# Altium project stend_update.PrjPcb
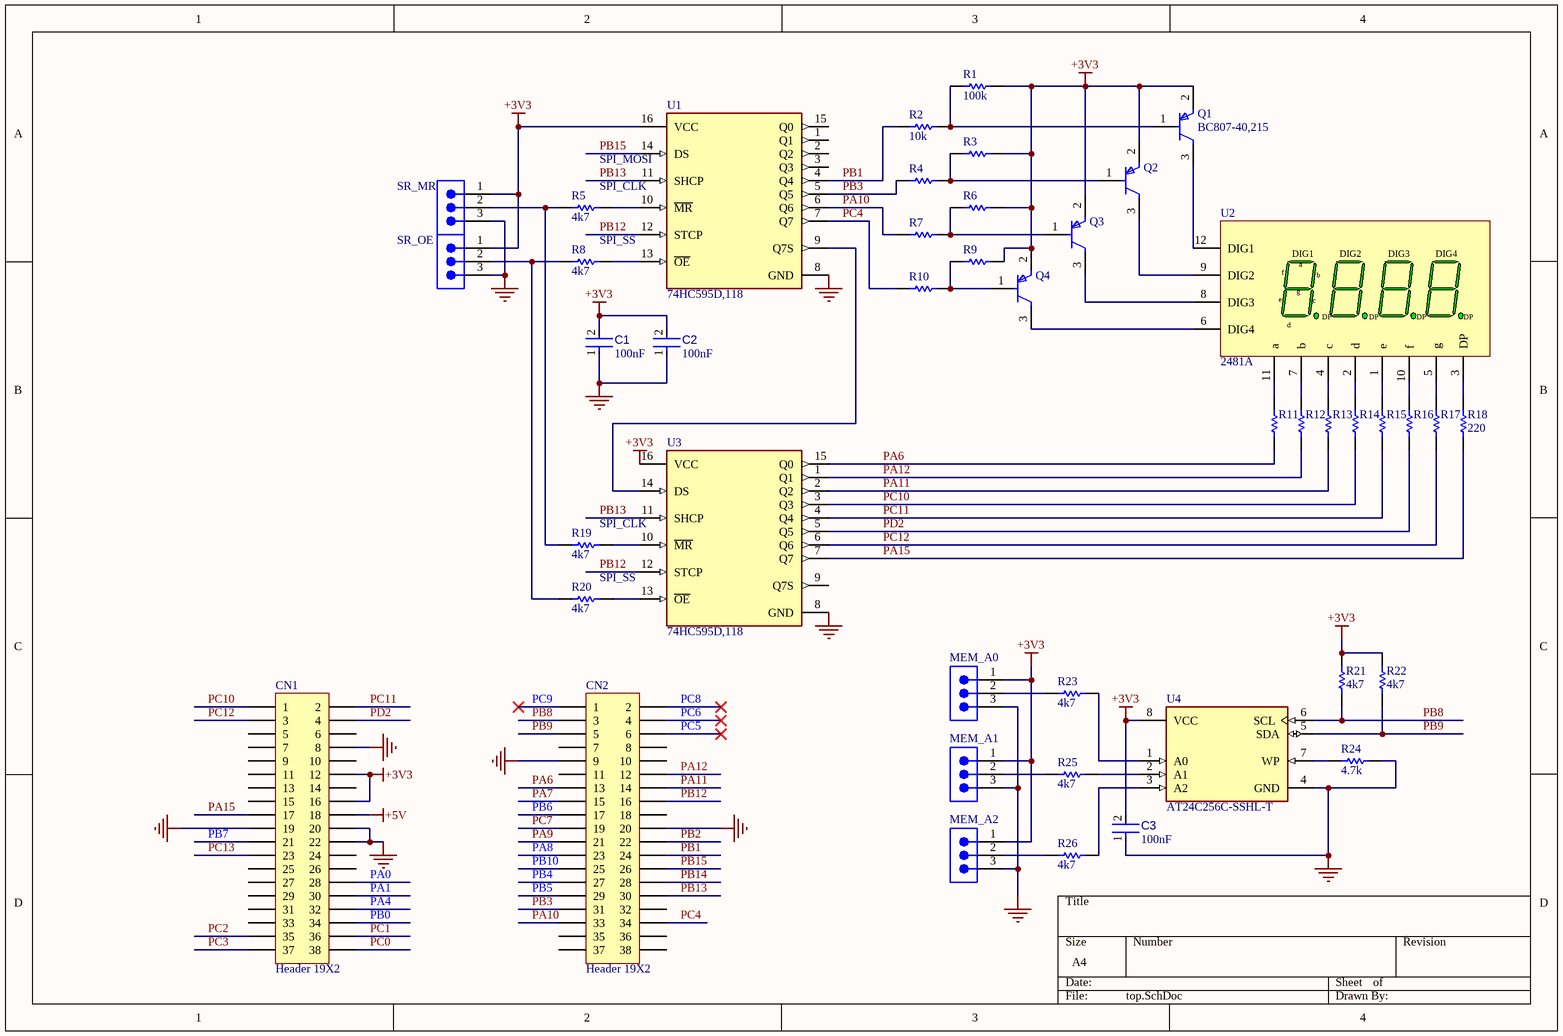
[diagram p0: top.SchDoc]
1 sheet, 44 parts. Net scope: global (net labels, ports and power ports of the same name join across sheets).
Board file: board.PcbDoc

## Sheet top.SchDoc
size A4

### Parts
C1  Capacitance: 100nF  [FP-0603-L_1_6_0_1-W_0_8_0-IPC_A]  (hidden comment: UMK107BJ104KAHT)
C2  Capacitance: 100nF  [FP-0603-L_1_6_0_1-W_0_8_0-IPC_A]  (hidden comment: UMK107BJ104KAHT)
C3  Capacitance: 100nF  [FP-0603-L_1_6_0_1-W_0_8_0-IPC_A]  (hidden comment: UMK107BJ104KAHT)
CN1  Header 19X2  [2*19P]
CN2  Header 19X2  [2*19P]
MEM_A0  TSW-103-07-F-S  [SMTC-TSW-103-07-X-S]  (value not drawn)
MEM_A1  TSW-103-07-F-S  [SMTC-TSW-103-07-X-S]  (value not drawn)
MEM_A2  TSW-103-07-F-S  [SMTC-TSW-103-07-X-S]  (value not drawn)
Q1  BC807-40,215  [FP-SOT23-IPC_A]
Q2  BC807-40,215  [FP-SOT23-IPC_A]  (value not drawn)
Q3  BC807-40,215  [FP-SOT23-IPC_A]  (value not drawn)
Q4  BC807-40,215  [FP-SOT23-IPC_A]  (value not drawn)
R1  value 100k  [RESC1609X55X30ML15T15]  (hidden comment: ERJ3EKF1002V)
R2  value 10k  [RESC1609X55X30ML15T15]  (hidden comment: ERJ3EKF1002V)
R3  ERJ3EKF1002V  [RESC1609X55X30ML15T15]  (value not drawn)
R4  ERJ3EKF1002V  [RESC1609X55X30ML15T15]  (value not drawn)
R5  value 4k7  [RESC1608X55X30ML15T15]  (hidden comment: ERJ-3EKF4701V)
R6  ERJ3EKF1002V  [RESC1609X55X30ML15T15]  (value not drawn)
R7  ERJ3EKF1002V  [RESC1609X55X30ML15T15]  (value not drawn)
R8  value 4k7  [RESC1608X55X30ML15T15]  (hidden comment: ERJ-3EKF4701V)
R9  ERJ3EKF1002V  [RESC1609X55X30ML15T15]  (value not drawn)
R10  ERJ3EKF1002V  [RESC1609X55X30ML15T15]  (value not drawn)
R11  ERJ3EKF1002V  [RESC1609X55X30ML15T15]  (value not drawn)
R12  ERJ3EKF1002V  [RESC1609X55X30ML15T15]  (value not drawn)
R13  ERJ3EKF1002V  [RESC1609X55X30ML15T15]  (value not drawn)
R14  ERJ3EKF1002V  [RESC1609X55X30ML15T15]  (value not drawn)
R15  ERJ3EKF1002V  [RESC1609X55X30ML15T15]  (value not drawn)
R16  ERJ3EKF1002V  [RESC1609X55X30ML15T15]  (value not drawn)
R17  ERJ3EKF1002V  [RESC1609X55X30ML15T15]  (value not drawn)
R18  value 220  [RESC1609X55X30ML15T15]  (hidden comment: ERJ3EKF1002V)
R19  value 4k7  [RESC1608X55X30ML15T15]  (hidden comment: ERJ-3EKF4701V)
R20  value 4k7  [RESC1608X55X30ML15T15]  (hidden comment: ERJ-3EKF4701V)
R21  value 4k7  [RESC1608X55X30ML15T15]  (hidden comment: ERJ-3EKF4701V)
R22  value 4k7  [RESC1608X55X30ML15T15]  (hidden comment: ERJ-3EKF4701V)
R23  value 4k7  [RESC1608X55X30ML15T15]  (hidden comment: ERJ-3EKF4701V)
R24  Resistance: 4.7k  [RESC1608X55X25ML10T15]  (hidden comment: RC0603FR-074K7L)
R25  value 4k7  [RESC1608X55X30ML15T15]  (hidden comment: ERJ-3EKF4701V)
R26  value 4k7  [RESC1608X55X30ML15T15]  (hidden comment: ERJ-3EKF4701V)
SR_MR  TSW-103-07-F-S  [SMTC-TSW-103-07-X-S]  (value not drawn)
SR_OE  TSW-103-07-F-S  [SMTC-TSW-103-07-X-S]  (value not drawn)
U1  74HC595D,118  [FP-SOT109-1-IPC_C]
U2  2481A  [2481A]
U3  74HC595D,118  [FP-SOT109-1-IPC_C]
U4  AT24C256C-SSHL-T  [FP-C04-057-SN-MFG]

### Nets
+3V3: C1.2 C2.2 C3.2 CN1.12 CN1.16 MEM_A0.1 MEM_A1.1 MEM_A2.1 Q1.2(E) Q2.2(E) Q3.2(E) Q4.2(E) R1.2 R3.2 R6.2 R9.2 R21.2 R22.2 SR_MR.1 SR_OE.1 U1.16(VCC) U3.16(VCC) U4.8(VCC)
+5V: CN1.18
GND: C1.1 C2.1 C3.1 CN1.8 CN1.19 CN1.20 CN1.22 CN2.9 CN2.20 MEM_A0.3 MEM_A1.3 MEM_A2.3 R24.2 SR_MR.3 SR_OE.3 U1.8(GND) U3.8(GND) U4.4(GND)
PA0: CN1.28
PA1: CN1.30
PA4: CN1.32
PA6: CN2.13 R11.1 U3.15(Q0)
PA7: CN2.15
PA8: CN2.23
PA9: CN2.21
PA10: CN2.33 R7.1 U1.6(Q6)
PA11: CN2.14 R13.1 U3.2(Q2)
PA12: CN2.12 R12.1 U3.1(Q1)
PA15: CN1.17 R18.1 U3.7(Q7)
PB0: CN1.34
PB1: CN2.24 R2.1 U1.4(Q4)
PB2: CN2.22
PB3: CN2.31 R4.1 U1.5(Q5)
PB4: CN2.27
PB5: CN2.29
PB6: CN2.17
PB7: CN1.21
PB8: CN2.3 R21.1 U4.6(SCL)
PB9: CN2.5 R22.1 U4.5(SDA)
PB10: CN2.25
PB12: CN2.16 U1.12(STCP) U3.12(STCP)
PB13: CN2.30 U1.11(SHCP) U3.11(SHCP)
PB14: CN2.28
PB15: CN2.26 U1.14(DS)
PC0: CN1.38
PC1: CN1.36
PC2: CN1.35
PC3: CN1.37
PC4: CN2.34 R10.1 U1.7(Q7)
PC5: CN2.6
PC6: CN2.4
PC7: CN2.19
PC8: CN2.2
PC9: CN2.1
PC10: CN1.1 R14.1 U3.3(Q3)
PC11: CN1.2 R15.1 U3.4(Q4)
PC12: CN1.3 R17.1 U3.6(Q6)
PC13: CN1.23
PD2: CN1.4 R16.1 U3.5(Q5)
NetMEM_A0_2: MEM_A0.2 R23.2
NetMEM_A1_2: MEM_A1.2 R25.2
NetMEM_A2_2: MEM_A2.2 R26.2
NetQ1_1: Q1.1(B) R1.1 R2.2
NetQ1_3: Q1.3(C) U2.12(DIG1)
NetQ2_1: Q2.1(B) R3.1 R4.2
NetQ2_3: Q2.3(C) U2.9(DIG2)
NetQ3_1: Q3.1(B) R6.1 R7.2
NetQ3_3: Q3.3(C) U2.8(DIG3)
NetQ4_1: Q4.1(B) R9.1 R10.2
NetQ4_3: Q4.3(C) U2.6(DIG4)
NetR5_1: R5.1 U1.10(~{MR})
NetR5_2: R5.2 R19.2 SR_MR.2
NetR8_1: R8.1 U1.13(~{OE})
NetR8_2: R8.2 R20.2 SR_OE.2
NetR11_2: R11.2 U2.11(a)
NetR12_2: R12.2 U2.7(b)
NetR13_2: R13.2 U2.4(c)
NetR14_2: R14.2 U2.2(d)
NetR15_2: R15.2 U2.1(e)
NetR16_2: R16.2 U2.10(f)
NetR17_2: R17.2 U2.5(g)
NetR18_2: R18.2 U2.3(DP)
NetR19_1: R19.1 U3.10(~{MR})
NetR20_1: R20.1 U3.13(~{OE})
NetR23_1: R23.1 U4.1(A0)
NetR24_1: R24.1 U4.7(WP)
NetR25_1: R25.1 U4.2(A1)
NetR26_1: R26.1 U4.3(A2)
NetU1_9: U1.9(Q7S) U3.14(DS)

Not connected (* = marked no-connect by the designer): CN1 5 6 7 9 10 11 13 14 15 24 25 26 27 29 31 33; CN2 7 8 10 11 18 32 35 36 37 38; U1 1(Q1) 2(Q2) 3(Q3) 15(Q0); U3 9(Q7S)

### Notes on the sheet
- (near U1) SPI_MOSI
- (near R8) SPI_SS
- (near R5) SPI_CLK
- (near R20) SPI_SS
- (near R19) SPI_CLK

### Library data of the parts
C1-C3 = CMP-14477-000532-1: Ceramic Capacitor Automotive 0.1uF ±10% 50V X5R 0603; Packaging: Tape and Reel; RoHS Compliant: Yes; Length: 0.063inch; Tolerance: 10%; Voltage Rating: 50V; Min Operating Temperature: -55°C; Ratings: AEC-Q200; Width: 0.031inch; Thickness: 0.035inch; Mount: Surface Mount; Height: 0.8mm; Termination: SMD/SMT; Dielectric: X5R; Package Quantity: 4000; Voltage Rating (DC): 50V; Case Code (Metric): 1608; Lead Free: Lead Free; Halogen Free: Halogen Free; Case/Package: 0603; Case Code (Imperial): 0603; Max Operating Temperature: 85°C
CN1 CN2 = Header 19X2: Header, 19-Pin, Dual row; Revision: 17-Jul-2002: Re-released for DXP Platform.; Publisher: Altium Limited
MEM_A0-MEM_A2 SR_MR SR_OE = CMP-1024-00331-1: 0.025" SQ Post Header, Through-hole, Vertical, -55 to 125 degC, 2.54 mm Pitch, 3-Pin, Male, RoHS; Manufacturer: Samtec; Pitch: 2.54 mm; DatasheetVersion: F-214; ComponentLink1Description: Manufacturer URL; ComponentLink3URL: http://www.samtec.com/documents/webfiles/cpdf/TSW-XXX-XX-XXX-X-XX-XXX-MKT.pdf; Mounting Technology: Through-hole; PackageDescription: .025[0.64] SQ. Post Terminal Strip Assembly; Temperature Range: -55 to 125 degC; ComponentLink3Description: Package Specification; Orientation: Vertical; PartNumber: TSW-103-07-F-S; RoHS: True; PackageVersion: DM, 8/1988; ComponentLink2Description: Datasheet; ComponentLink1URL: http://www.samtec.com; ComponentLink2URL: http://www.samtec.com/documents/webfiles/pdf/TSW_TH.PDF; PackageReference: TSW-103-07-X-S
Q1-Q4 = CMP-14406-000042-1: TRANS PNP 45V 500MA TO236AB; RoHS Compliant: Yes
R1 R2 R18 = CMP-1012-00623-3: Chip Resistor, 10 KOhm, +/- 1%, 0.1 W, -55 to 155 degC, 0603 (1608 Metric), RoHS, Tape and Reel; Manufacturer: Panasonic; Voltage Rating: 75V; Case\/Package: 0603; Power Rating: 100mW; Resistance: 10KOhm; Temperature Coefficient: 100ppm\/degreesC; Number of Pins: 2; Package Reference: 603; Depth: 0.8mm; Mount: SurfaceMount; Package Description: 2-Pin Surface Mount Device, Body 1.6 x 0.85 mm; Datasheet Version: 02/2017; Length: 1.6mm; Lead Free: LeadFree; Height: 0.45mm; Number of Terminations: 2; Max Power Dissipation: 100mW; Min Operating Temperature: -55degC; Datasheet URL: https://industrial.panasonic.com/cdbs/www-data/pdf/RDA0000/AOA0000C304.pdf; Termination: SMD/SMT; Case Code (Metric): 1608; Case Code (Imperial): 0603; Tolerance: 1%; Max Operating Temperature: 155degC; RoHSCompliant: true; Voltage Rating (DC): 75V; Radiation Hardening: No; Packaging: TapeandReel; Composition: ThickFilm; Mounting Technology: SurfaceMount; Manufacturer URL: http://www.panasonic.com/; Width: 0.031inch; REACH SVHC: NoSVHC; Contact Plating: Tin; Military Standard: Not; Package Quantity: 1
R3 R6 R9 = CMP-1012-00623-3: Chip Resistor, 10 KOhm, +/- 1%, 0.1 W, -55 to 155 degC, 0603 (1608 Metric), RoHS, Tape and Reel; Manufacturer: Panasonic; Voltage Rating: 75V; Case\/Package: 0603; Power Rating: 100mW; Resistance: 10KOhm; Temperature Coefficient: 100ppm\/degreesC; Value: 100k; Number of Pins: 2; Package Reference: 603; Depth: 0.8mm; Mount: SurfaceMount; Package Description: 2-Pin Surface Mount Device, Body 1.6 x 0.85 mm; Datasheet Version: 02/2017; Length: 1.6mm; Lead Free: LeadFree; Height: 0.45mm; Number of Terminations: 2; Max Power Dissipation: 100mW; Min Operating Temperature: -55degC; Datasheet URL: https://industrial.panasonic.com/cdbs/www-data/pdf/RDA0000/AOA0000C304.pdf; Termination: SMD/SMT; Case Code (Metric): 1608; Case Code (Imperial): 0603; Tolerance: 1%; Max Operating Temperature: 155degC; RoHSCompliant: true; Voltage Rating (DC): 75V; Radiation Hardening: No; Packaging: TapeandReel; Composition: ThickFilm; Mounting Technology: SurfaceMount; Manufacturer URL: http://www.panasonic.com/; Width: 0.031inch; REACH SVHC: NoSVHC; Contact Plating: Tin; Military Standard: Not; Package Quantity: 1
R4 R7 R10 = CMP-1012-00623-3: Chip Resistor, 10 KOhm, +/- 1%, 0.1 W, -55 to 155 degC, 0603 (1608 Metric), RoHS, Tape and Reel; Manufacturer: Panasonic; Voltage Rating: 75V; Case\/Package: 0603; Power Rating: 100mW; Resistance: 10KOhm; Temperature Coefficient: 100ppm\/degreesC; Value: 10k; Number of Pins: 2; Package Reference: 603; Depth: 0.8mm; Mount: SurfaceMount; Package Description: 2-Pin Surface Mount Device, Body 1.6 x 0.85 mm; Datasheet Version: 02/2017; Length: 1.6mm; Lead Free: LeadFree; Height: 0.45mm; Number of Terminations: 2; Max Power Dissipation: 100mW; Min Operating Temperature: -55degC; Datasheet URL: https://industrial.panasonic.com/cdbs/www-data/pdf/RDA0000/AOA0000C304.pdf; Termination: SMD/SMT; Case Code (Metric): 1608; Case Code (Imperial): 0603; Tolerance: 1%; Max Operating Temperature: 155degC; RoHSCompliant: true; Voltage Rating (DC): 75V; Radiation Hardening: No; Packaging: TapeandReel; Composition: ThickFilm; Mounting Technology: SurfaceMount; Manufacturer URL: http://www.panasonic.com/; Width: 0.031inch; REACH SVHC: NoSVHC; Contact Plating: Tin; Military Standard: Not; Package Quantity: 1
R5 R8 R19-R23 R25 R26 = CMP-1012-00586-3: Precision Thick Film Chip Resistor, 4.7 KOhm, +/- 1%, -55 to 155 degC, 0603 (1608 Metric), RoHS, Tape and Reel; Resistance: 220 Ohm; Voltage Rating: 50 V; Elements: 4; Case\Package: 1205; Tolerance: 5%; Power Rating: 250 mW; PackageReference: 0603; Max Operating Temperature: 125 degC; REACH SVHC: No SVHC; Width: 0.063 inch; Length: 0.126 inch; Height: 0.024 inch; Mount: Surface Mount; Package Quantity: 1; DatasheetVersion: Apr-15; ComponentLink1Description: Manufacturer URL; Min Operating Temperature: -55 degC; Packaging: Tape and Reel; Radiation Hardening: No; ComponentLink2URL: http://industrial.panasonic.com/cdbs/www-data/pdf/RDA0000/AOA0000C86.pdf; Case Code (Metric): 3216; Pins: 8; Case Code (Imperial): 1206; Type (Resistor): Thick Film; RoHSCompliant: true; ComponentLink2Description: Datasheet; PackageDescription: 2-Pin Surface Mount Device, Body 1.6 x 0.85 mm; ComponentLink1URL: http://www.panasonic.com/
R11-R17 = CMP-1012-00623-3: Chip Resistor, 10 KOhm, +/- 1%, 0.1 W, -55 to 155 degC, 0603 (1608 Metric), RoHS, Tape and Reel; Manufacturer: Panasonic; Voltage Rating: 75V; Case\/Package: 0603; Power Rating: 100mW; Resistance: 10KOhm; Temperature Coefficient: 100ppm\/degreesC; Value: 220; Number of Pins: 2; Package Reference: 603; Depth: 0.8mm; Mount: SurfaceMount; Package Description: 2-Pin Surface Mount Device, Body 1.6 x 0.85 mm; Datasheet Version: 02/2017; Length: 1.6mm; Lead Free: LeadFree; Height: 0.45mm; Number of Terminations: 2; Max Power Dissipation: 100mW; Min Operating Temperature: -55degC; Datasheet URL: https://industrial.panasonic.com/cdbs/www-data/pdf/RDA0000/AOA0000C304.pdf; Termination: SMD/SMT; Case Code (Metric): 1608; Case Code (Imperial): 0603; Tolerance: 1%; Max Operating Temperature: 155degC; RoHSCompliant: true; Voltage Rating (DC): 75V; Radiation Hardening: No; Packaging: TapeandReel; Composition: ThickFilm; Mounting Technology: SurfaceMount; Manufacturer URL: http://www.panasonic.com/; Width: 0.031inch; REACH SVHC: NoSVHC; Contact Plating: Tin; Military Standard: Not; Package Quantity: 1
R24 = CMP-2000-06942-1: Chip Resistor, 4.7 KOhm, +/- 1%, 0.1 W, -55 to 155 degC, 0603 (1608 Metric), RoHS, Tape and Reel; Manufacturer: Yageo; Power Rating: 100mW; Temperature Coefficient: 100PPM/C; Voltage Rating: 50V; Package Reference: 0603; Series: RC; Datasheet Version: Rev. 7, 05/2017; Packaging: Reel; Termination Style: SMD/SMT; Datasheet URL: http://www.yageo.com/documents/recent/PYu-RC_Group_51_RoHS_L_7.pdf; Manufacturer URL: http://www.yageo.com/; Package Description: 2-Pin Surface Mount Device, Body 1.6 x 0.8 mm; Case Code - mm: 1608; Case Code - in: 0603; Mounting Technology: SurfaceMount; Operating Temperature Range: -55Cto+155C; Tolerance: 1%; Product: ThickFilmResistorsGeneralPurpose
U1 U3 = CMP-14351-000006-1: IC SHIFT REGISTER 8BIT 16SOIC; RoHS Compliant: Yes
U2 = 2481A: 7-segment, common-catode
U4 = CMP-06313-000129-1: IC EEPROM 1KBIT I2C 1MHZ 8SOIC; Access Time: 4.5us; Memory Type: Non-Volatile; Memory Size: 1Kb; Series: -; Number of Pins: 8; Case/Package: SOIC; RoHS Compliant: Yes; Max Operating Temperature: 85°C; Packaging: Cut Tape; Min Operating Temperature: -40°C; Mount: Surface Mount; Frequency: 1MHz